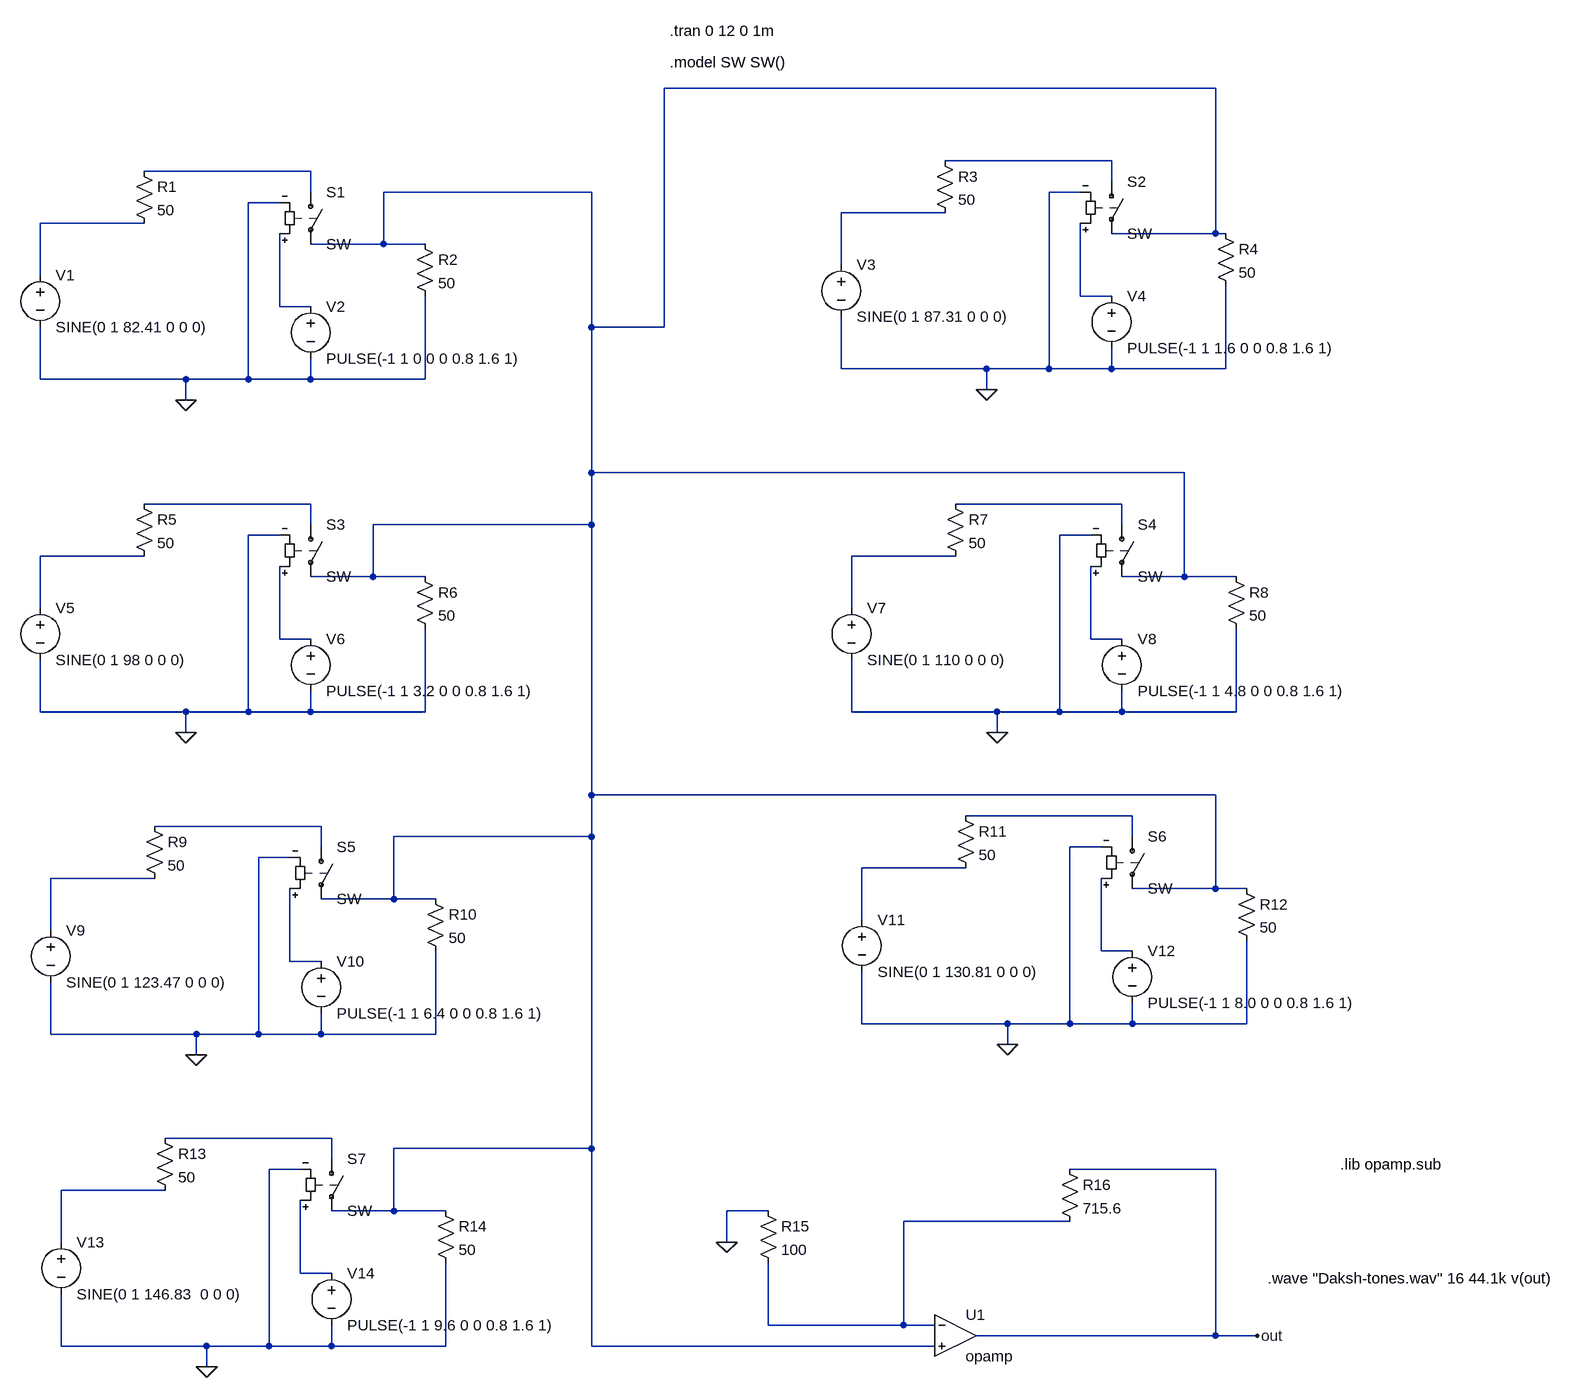
[diagram p0: schematic Draft2.asc]
Draft2.asc, the LTspice schematic file:
Version 4
SHEET 1 1784 1876
WIRE 1216 -112 368 -112
WIRE 1056 0 800 0
WIRE -176 16 -432 16
WIRE 1056 32 1056 0
WIRE -176 48 -176 16
WIRE 256 48 -64 48
WIRE 1008 48 960 48
WIRE -224 64 -272 64
WIRE 800 80 640 80
WIRE -432 96 -592 96
WIRE 1216 112 1216 -112
WIRE 1216 112 1056 112
WIRE 1232 112 1216 112
WIRE -64 128 -64 48
WIRE -64 128 -176 128
WIRE 0 128 -64 128
WIRE 640 160 640 80
WIRE -592 176 -592 96
WIRE 1008 208 1008 96
WIRE 1056 208 1008 208
WIRE -224 224 -224 112
WIRE -176 224 -224 224
WIRE 256 256 256 48
WIRE 368 256 368 -112
WIRE 368 256 256 256
WIRE 640 320 640 240
WIRE 864 320 640 320
WIRE 960 320 960 48
WIRE 960 320 864 320
WIRE 1056 320 1056 288
WIRE 1056 320 960 320
WIRE 1232 320 1232 192
WIRE 1232 320 1056 320
WIRE -592 336 -592 256
WIRE -368 336 -592 336
WIRE -272 336 -272 64
WIRE -272 336 -368 336
WIRE -176 336 -176 304
WIRE -176 336 -272 336
WIRE 0 336 0 208
WIRE 0 336 -176 336
WIRE 864 352 864 320
WIRE -368 368 -368 336
WIRE 256 480 256 256
WIRE 1168 480 256 480
WIRE -176 528 -432 528
WIRE 1072 528 816 528
WIRE -176 560 -176 528
WIRE 256 560 256 480
WIRE 256 560 -80 560
WIRE 1072 560 1072 528
WIRE -224 576 -272 576
WIRE 1024 576 976 576
WIRE -432 608 -592 608
WIRE 816 608 656 608
WIRE -80 640 -80 560
WIRE -80 640 -176 640
WIRE 0 640 -80 640
WIRE 1168 640 1168 480
WIRE 1168 640 1072 640
WIRE 1248 640 1168 640
WIRE -592 688 -592 608
WIRE 656 688 656 608
WIRE -224 736 -224 624
WIRE -176 736 -224 736
WIRE 1024 736 1024 624
WIRE 1072 736 1024 736
WIRE -592 848 -592 768
WIRE -368 848 -592 848
WIRE -272 848 -272 576
WIRE -272 848 -368 848
WIRE -176 848 -176 816
WIRE -176 848 -272 848
WIRE 0 848 0 720
WIRE 0 848 -176 848
WIRE 656 848 656 768
WIRE 880 848 656 848
WIRE 976 848 976 576
WIRE 976 848 880 848
WIRE 1072 848 1072 816
WIRE 1072 848 976 848
WIRE 1248 848 1248 720
WIRE 1248 848 1072 848
WIRE -368 880 -368 848
WIRE 880 880 880 848
WIRE 256 976 256 560
WIRE 1216 976 256 976
WIRE 1088 1008 832 1008
WIRE -160 1024 -416 1024
WIRE 256 1040 256 976
WIRE 256 1040 -48 1040
WIRE 1088 1040 1088 1008
WIRE -160 1056 -160 1024
WIRE 1040 1056 992 1056
WIRE -208 1072 -256 1072
WIRE 832 1088 672 1088
WIRE -416 1104 -576 1104
WIRE 1216 1120 1216 976
WIRE 1216 1120 1088 1120
WIRE 1264 1120 1216 1120
WIRE -48 1136 -48 1040
WIRE -48 1136 -160 1136
WIRE 16 1136 -48 1136
WIRE 672 1168 672 1088
WIRE -576 1184 -576 1104
WIRE 1040 1216 1040 1104
WIRE 1088 1216 1040 1216
WIRE -208 1232 -208 1120
WIRE -160 1232 -208 1232
WIRE 672 1328 672 1248
WIRE 896 1328 672 1328
WIRE 992 1328 992 1056
WIRE 992 1328 896 1328
WIRE 1088 1328 1088 1296
WIRE 1088 1328 992 1328
WIRE 1264 1328 1264 1200
WIRE 1264 1328 1088 1328
WIRE -576 1344 -576 1264
WIRE -352 1344 -576 1344
WIRE -256 1344 -256 1072
WIRE -256 1344 -352 1344
WIRE -160 1344 -160 1312
WIRE -160 1344 -256 1344
WIRE 16 1344 16 1216
WIRE 16 1344 -160 1344
WIRE 896 1360 896 1328
WIRE -352 1376 -352 1344
WIRE -144 1504 -400 1504
WIRE 256 1520 256 1040
WIRE 256 1520 -48 1520
WIRE -144 1536 -144 1504
WIRE -192 1552 -240 1552
WIRE 1216 1552 992 1552
WIRE -400 1584 -560 1584
WIRE -48 1616 -48 1520
WIRE -48 1616 -144 1616
WIRE 32 1616 -48 1616
WIRE 528 1616 464 1616
WIRE 992 1632 736 1632
WIRE -560 1664 -560 1584
WIRE 464 1664 464 1616
WIRE -192 1712 -192 1600
WIRE -144 1712 -192 1712
WIRE 528 1792 528 1696
WIRE 736 1792 736 1632
WIRE 736 1792 528 1792
WIRE 784 1792 736 1792
WIRE 1216 1808 1216 1552
WIRE 1216 1808 848 1808
WIRE 1280 1808 1216 1808
WIRE -560 1824 -560 1744
WIRE -336 1824 -560 1824
WIRE -240 1824 -240 1552
WIRE -240 1824 -336 1824
WIRE -144 1824 -144 1792
WIRE -144 1824 -240 1824
WIRE 32 1824 32 1696
WIRE 32 1824 -144 1824
WIRE 256 1824 256 1520
WIRE 784 1824 256 1824
WIRE -336 1856 -336 1824
FLAG -368 368 0
FLAG 864 352 0
FLAG -368 880 0
FLAG 880 880 0
FLAG -352 1376 0
FLAG 896 1360 0
FLAG -336 1856 0
FLAG 464 1664 0
FLAG 1280 1808 out
SYMBOL voltage -592 160 R0
WINDOW 123 0 0 Left 0
WINDOW 39 0 0 Left 0
SYMATTR InstName V1
SYMATTR Value SINE(0 1 82.41 0 0 0)
SYMBOL sw -176 32 R0
SYMATTR InstName S1
SYMBOL voltage -176 208 R0
WINDOW 123 0 0 Left 0
WINDOW 39 0 0 Left 0
SYMATTR InstName V2
SYMATTR Value PULSE(-1 1 0 0 0 0.8 1.6 1)
SYMBOL res -448 0 R0
SYMATTR InstName R1
SYMATTR Value 50
SYMBOL res -16 112 R0
SYMATTR InstName R2
SYMATTR Value 50
SYMBOL voltage 640 144 R0
WINDOW 123 0 0 Left 0
WINDOW 39 0 0 Left 0
SYMATTR InstName V3
SYMATTR Value SINE(0 1 87.31 0 0 0)
SYMBOL sw 1056 16 R0
SYMATTR InstName S2
SYMBOL voltage 1056 192 R0
WINDOW 123 0 0 Left 0
WINDOW 39 0 0 Left 0
SYMATTR InstName V4
SYMATTR Value PULSE(-1 1 1.6 0 0 0.8 1.6 1)
SYMBOL res 784 -16 R0
SYMATTR InstName R3
SYMATTR Value 50
SYMBOL res 1216 96 R0
SYMATTR InstName R4
SYMATTR Value 50
SYMBOL voltage -592 672 R0
WINDOW 123 0 0 Left 0
WINDOW 39 0 0 Left 0
SYMATTR InstName V5
SYMATTR Value SINE(0 1 98 0 0 0)
SYMBOL sw -176 544 R0
SYMATTR InstName S3
SYMBOL voltage -176 720 R0
WINDOW 123 0 0 Left 0
WINDOW 39 0 0 Left 0
SYMATTR InstName V6
SYMATTR Value PULSE(-1 1 3.2 0 0 0.8 1.6 1)
SYMBOL res -448 512 R0
SYMATTR InstName R5
SYMATTR Value 50
SYMBOL res -16 624 R0
SYMATTR InstName R6
SYMATTR Value 50
SYMBOL voltage 656 672 R0
WINDOW 123 0 0 Left 0
WINDOW 39 0 0 Left 0
SYMATTR InstName V7
SYMATTR Value SINE(0 1 110 0 0 0)
SYMBOL sw 1072 544 R0
SYMATTR InstName S4
SYMBOL voltage 1072 720 R0
WINDOW 123 0 0 Left 0
WINDOW 39 0 0 Left 0
SYMATTR InstName V8
SYMATTR Value PULSE(-1 1 4.8 0 0 0.8 1.6 1)
SYMBOL res 800 512 R0
SYMATTR InstName R7
SYMATTR Value 50
SYMBOL res 1232 624 R0
SYMATTR InstName R8
SYMATTR Value 50
SYMBOL voltage -576 1168 R0
WINDOW 123 0 0 Left 0
WINDOW 39 0 0 Left 0
SYMATTR InstName V9
SYMATTR Value SINE(0 1 123.47 0 0 0)
SYMBOL sw -160 1040 R0
SYMATTR InstName S5
SYMBOL voltage -160 1216 R0
WINDOW 123 0 0 Left 0
WINDOW 39 0 0 Left 0
SYMATTR InstName V10
SYMATTR Value PULSE(-1 1 6.4 0 0 0.8 1.6 1)
SYMBOL res -432 1008 R0
SYMATTR InstName R9
SYMATTR Value 50
SYMBOL res 0 1120 R0
SYMATTR InstName R10
SYMATTR Value 50
SYMBOL voltage 672 1152 R0
WINDOW 123 0 0 Left 0
WINDOW 39 0 0 Left 0
SYMATTR InstName V11
SYMATTR Value SINE(0 1 130.81 0 0 0)
SYMBOL sw 1088 1024 R0
SYMATTR InstName S6
SYMBOL voltage 1088 1200 R0
WINDOW 123 0 0 Left 0
WINDOW 39 0 0 Left 0
SYMATTR InstName V12
SYMATTR Value PULSE(-1 1 8.0 0 0 0.8 1.6 1)
SYMBOL res 816 992 R0
SYMATTR InstName R11
SYMATTR Value 50
SYMBOL res 1248 1104 R0
SYMATTR InstName R12
SYMATTR Value 50
SYMBOL voltage -560 1648 R0
WINDOW 123 0 0 Left 0
WINDOW 39 0 0 Left 0
SYMATTR InstName V13
SYMATTR Value SINE(0 1 146.83  0 0 0)
SYMBOL sw -144 1520 R0
SYMATTR InstName S7
SYMBOL voltage -144 1696 R0
WINDOW 123 0 0 Left 0
WINDOW 39 0 0 Left 0
SYMATTR InstName V14
SYMATTR Value PULSE(-1 1 9.6 0 0 0.8 1.6 1)
SYMBOL res -416 1488 R0
SYMATTR InstName R13
SYMATTR Value 50
SYMBOL res 16 1600 R0
SYMATTR InstName R14
SYMATTR Value 50
SYMBOL OpAmps\\opamp 816 1744 R0
SYMATTR InstName U1
SYMBOL res 512 1600 R0
SYMATTR InstName R15
SYMATTR Value 100
SYMBOL res 976 1536 R0
SYMATTR InstName R16
SYMATTR Value 715.6
TEXT 376 -200 Left 2 !.tran 0 12 0 1m
TEXT 376 -152 Left 2 !.model SW SW()
TEXT 1408 1544 Left 2 !.lib opamp.sub
TEXT 1296 1720 Left 2 !.wave "Daksh-tones.wav" 16 44.1k v(out)

The netlist it stands for:
* Draft2.asc
V1 N005 0 SINE(0 1 82.41 0 0 0)
S1 N003 N001 N007 0 SW
V2 N007 0 PULSE(-1 1 0 0 0 0.8 1.6 1)
R1 N003 N005 50
R2 N001 0 50
V3 N004 0 SINE(0 1 87.31 0 0 0)
S2 N002 N001 N006 0 SW
V4 N006 0 PULSE(-1 1 1.6 0 0 0.8 1.6 1)
R3 N002 N004 50
R4 N001 0 50
V5 N010 0 SINE(0 1 98 0 0 0)
S3 N008 N001 N012 0 SW
V6 N012 0 PULSE(-1 1 3.2 0 0 0.8 1.6 1)
R5 N008 N010 50
R6 N001 0 50
V7 N011 0 SINE(0 1 110 0 0 0)
S4 N009 N001 N013 0 SW
V8 N013 0 PULSE(-1 1 4.8 0 0 0.8 1.6 1)
R7 N009 N011 50
R8 N001 0 50
V9 N017 0 SINE(0 1 123.47 0 0 0)
S5 N015 N001 N019 0 SW
V10 N019 0 PULSE(-1 1 6.4 0 0 0.8 1.6 1)
R9 N015 N017 50
R10 N001 0 50
V11 N016 0 SINE(0 1 130.81 0 0 0)
S6 N014 N001 N018 0 SW
V12 N018 0 PULSE(-1 1 8.0 0 0 0.8 1.6 1)
R11 N014 N016 50
R12 N001 0 50
V13 N021 0 SINE(0 1 146.83  0 0 0)
S7 N020 N001 N023 0 SW
V14 N023 0 PULSE(-1 1 9.6 0 0 0.8 1.6 1)
R13 N020 N021 50
R14 N001 0 50
XU1 N022 N001 out opamp Aol=100K GBW=10Meg  ; pins invin noninvin out
R15 0 N022 100
R16 out N022 715.6
.tran 0 12 0 1m
.model SW SW()
.lib opamp.sub
.wave "Daksh-tones.wav" 16 44.1k v(out)
.backanno
.end